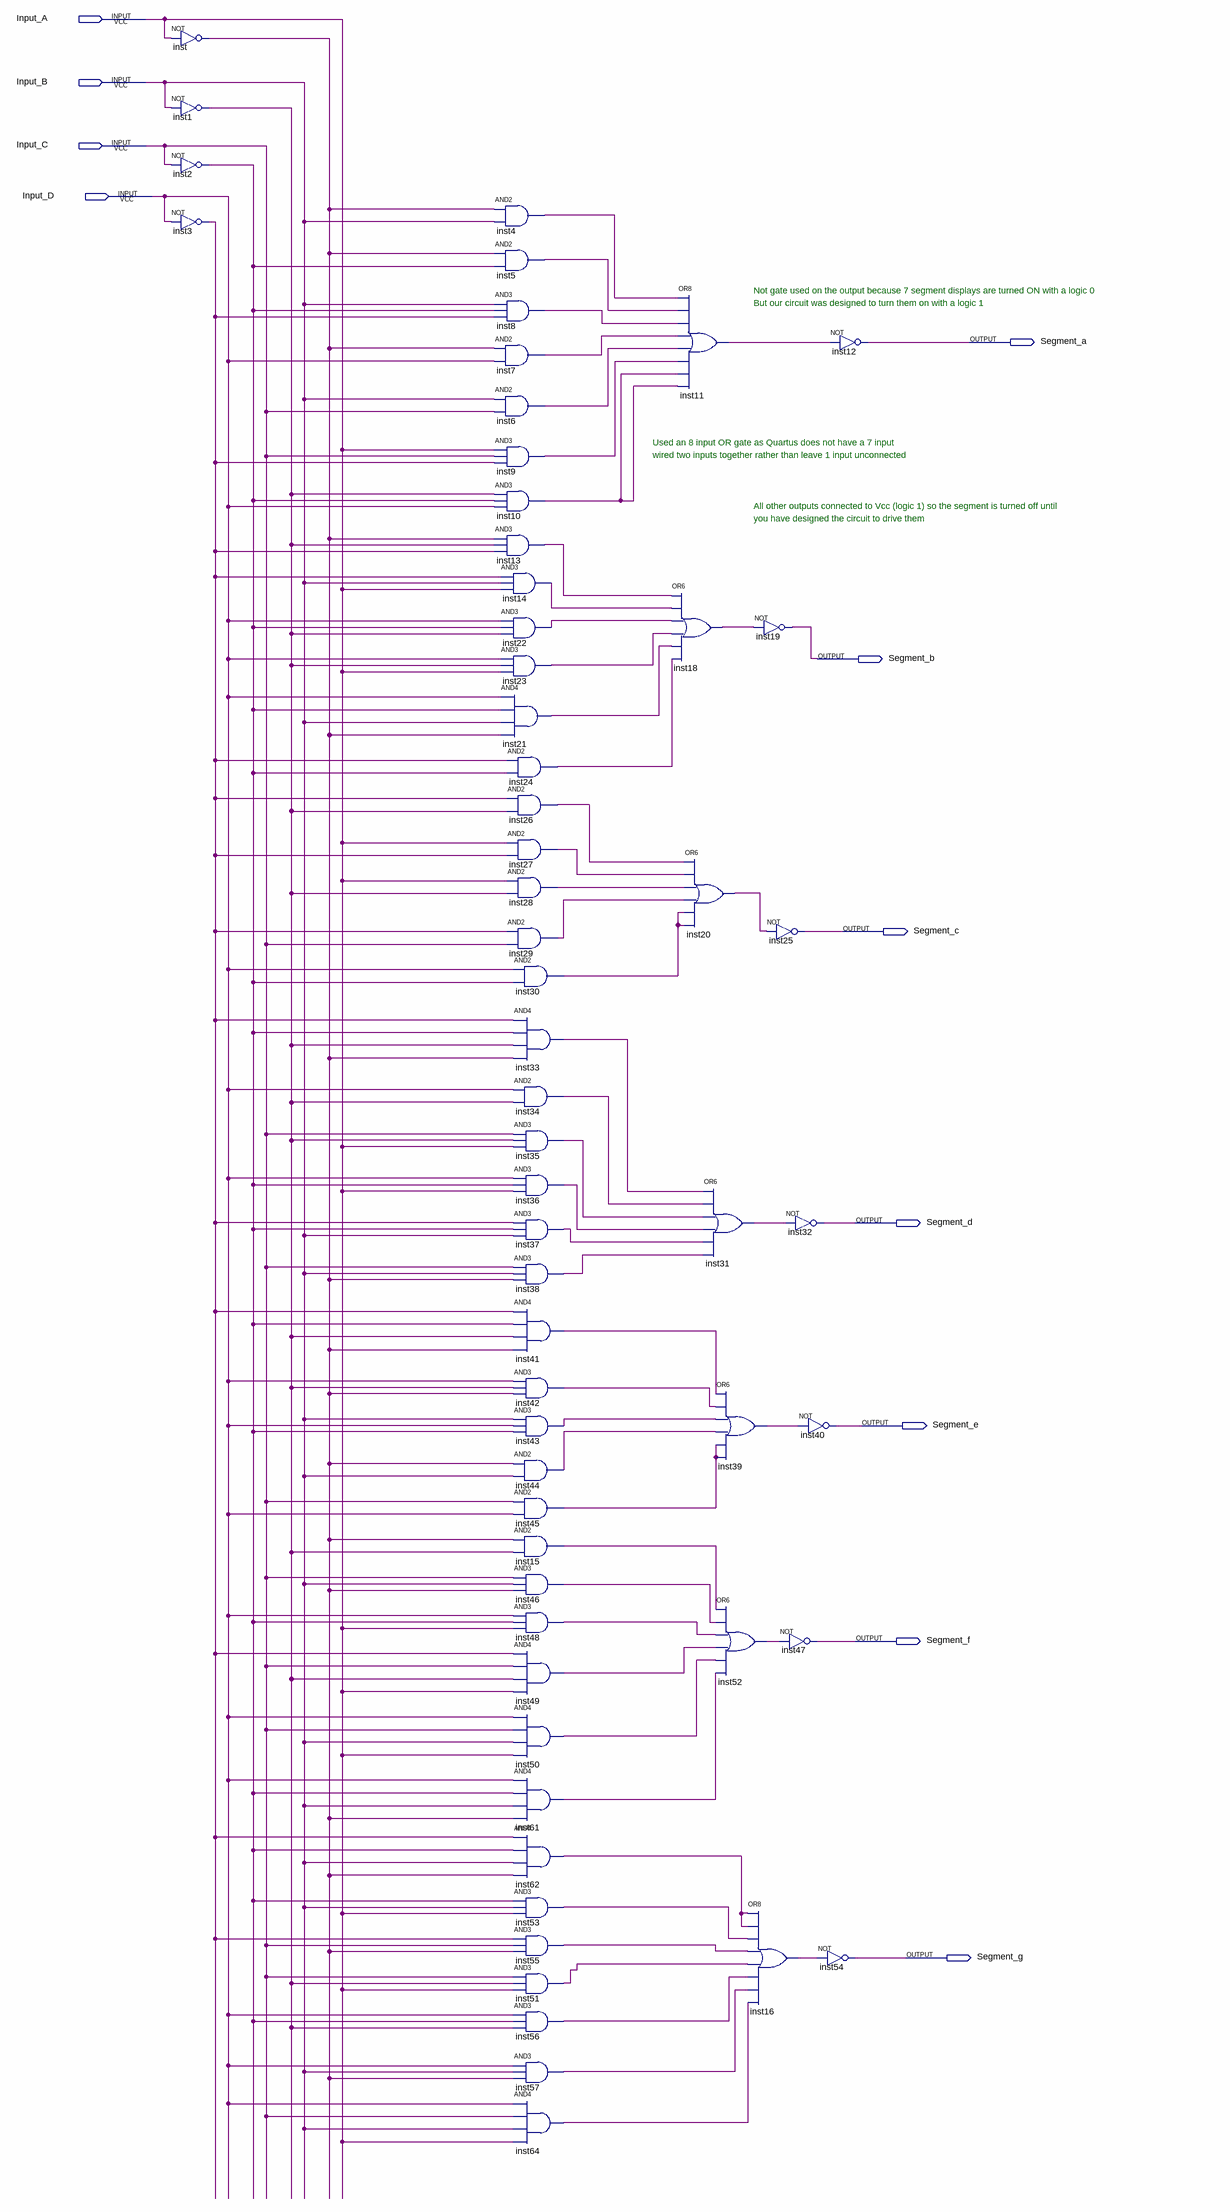
[diagram p0: schematic sheet]
// Quartus schematic HexTo7SegmentDisplayDriver.bdf as structural Verilog: 60 symbols, 11 pins
module HexTo7SegmentDisplayDriver (
  input  Input_A,
  input  Input_B,
  input  Input_C,
  input  Input_D,
  output Segment_a,
  output Segment_b,
  output Segment_c,
  output Segment_d,
  output Segment_e,
  output Segment_f,
  output Segment_g
);

  wire inst1_out, inst2_out, inst3_out, inst4_out, inst5_out, inst6_out, inst7_out, inst8_out, inst9_out,
       inst10_out, inst11_out, inst13_out, inst14_out, inst15_out, inst16_out, inst18_out, inst20_out,
       inst21_out, inst22_out, inst23_out, inst24_out, inst26_out, inst27_out, inst28_out, inst29_out,
       inst30_out, inst31_out, inst33_out, inst34_out, inst35_out, inst36_out, inst37_out, inst38_out,
       inst39_out, inst41_out, inst42_out, inst43_out, inst44_out, inst45_out, inst46_out, inst48_out,
       inst49_out, inst50_out, inst51_out, inst52_out, inst53_out, inst55_out, inst56_out, inst57_out,
       inst61_out, inst62_out, inst64_out, inst_out;

  not inst (inst_out, Input_A);
  not inst1 (inst1_out, Input_B);
  not inst2 (inst2_out, Input_C);
  not inst3 (inst3_out, Input_D);
  and inst4 (inst4_out, inst_out, Input_B);
  and inst5 (inst5_out, inst_out, inst2_out);
  and inst8 (inst8_out, Input_B, inst2_out, inst3_out);
  and inst7 (inst7_out, inst_out, Input_D);
  and inst6 (inst6_out, Input_B, Input_C);
  and inst9 (inst9_out, Input_A, Input_C, inst3_out);
  and inst10 (inst10_out, inst1_out, inst2_out, Input_D);
  and inst13 (inst13_out, inst_out, inst1_out, inst3_out);
  and inst14 (inst14_out, inst3_out, Input_B, Input_A);
  and inst22 (inst22_out, Input_D, inst2_out, inst1_out);
  and inst23 (inst23_out, Input_D, inst1_out, Input_A);
  and inst21 (inst21_out, Input_D, inst2_out, Input_B, inst_out);
  and inst24 (inst24_out, inst3_out, inst2_out);
  and inst26 (inst26_out, inst3_out, inst1_out);
  and inst27 (inst27_out, Input_A, inst3_out);
  and inst28 (inst28_out, Input_A, inst1_out);
  and inst29 (inst29_out, inst3_out, Input_C);
  and inst30 (inst30_out, Input_D, inst2_out);
  and inst33 (inst33_out, inst3_out, inst2_out, inst1_out, inst_out);
  and inst34 (inst34_out, Input_D, inst1_out);
  and inst35 (inst35_out, Input_C, inst1_out, Input_A);
  and inst36 (inst36_out, Input_D, inst2_out, Input_A);
  and inst37 (inst37_out, inst3_out, inst2_out, Input_B);
  and inst38 (inst38_out, Input_C, Input_B, inst_out);
  and inst41 (inst41_out, inst3_out, inst2_out, inst1_out, inst_out);
  and inst42 (inst42_out, Input_D, inst1_out, inst_out);
  and inst43 (inst43_out, Input_B, Input_D, inst2_out);
  and inst44 (inst44_out, inst_out, Input_B);
  and inst45 (inst45_out, Input_C, Input_D);
  and inst15 (inst15_out, inst_out, inst1_out);
  and inst46 (inst46_out, Input_C, Input_B, inst_out);
  and inst48 (inst48_out, Input_D, inst2_out, Input_A);
  and inst49 (inst49_out, inst3_out, Input_C, inst1_out, Input_A);
  and inst50 (inst50_out, Input_D, Input_C, Input_B, Input_A);
  and inst61 (inst61_out, Input_D, inst2_out, Input_B, inst_out);
  and inst62 (inst62_out, inst3_out, inst2_out, Input_B, inst_out);
  and inst53 (inst53_out, inst2_out, Input_B, Input_A);
  and inst55 (inst55_out, inst3_out, Input_C, inst_out);
  and inst51 (inst51_out, Input_C, inst1_out, Input_A);
  and inst56 (inst56_out, Input_D, inst2_out, inst1_out);
  and inst57 (inst57_out, Input_D, Input_B, inst_out);
  and inst64 (inst64_out, Input_D, Input_C, Input_B, Input_A);
  or inst11 (inst11_out, inst4_out, inst5_out, inst8_out, inst7_out, inst6_out, inst9_out, inst10_out, inst10_out);
  or inst18 (inst18_out, inst13_out, inst14_out, inst22_out, inst23_out, inst21_out, inst24_out);
  or inst20 (inst20_out, inst26_out, inst27_out, inst28_out, inst29_out, inst30_out, inst30_out);
  or inst31 (inst31_out, inst33_out, inst34_out, inst35_out, inst36_out, inst37_out, inst38_out);
  or inst39 (inst39_out, inst41_out, inst42_out, inst43_out, inst44_out, inst45_out, inst45_out);
  or inst52 (inst52_out, inst15_out, inst46_out, inst48_out, inst49_out, inst50_out, inst61_out);
  not inst19 (Segment_b, inst18_out);
  not inst25 (Segment_c, inst20_out);
  not inst32 (Segment_d, inst31_out);
  not inst47 (Segment_f, inst52_out);
  or inst16 (inst16_out, inst62_out, inst62_out, inst53_out, inst55_out, inst51_out, inst56_out, inst57_out, inst64_out);
  not inst12 (Segment_a, inst11_out);
  not inst40 (Segment_e, inst39_out);
  not inst54 (Segment_g, inst16_out);

  // Notes on the sheet:
  //   Not gate used on the output because 7 segment displays are turned ON with a logic 0
  //   But our circuit was designed to turn them on with a logic 1
  //   Used an 8 input OR gate as Quartus does not have a 7 input
  //   wired two inputs together rather than leave 1 input unconnected
  //   All other outputs connected to Vcc (logic 1) so the segment is turned off until 
  //   you have designed the circuit to drive them
endmodule
